# Altium schematic sheet Power.SchDoc
size A4; SheetNumber: 1; SheetTotal: 1
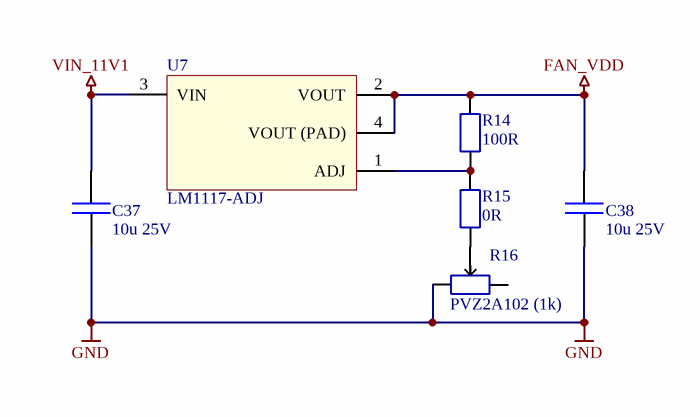
[diagram p0: Power.SchDoc]

## Parts
C37  10u 25V  [C_1206/3216]
C38  10u 25V  [C_1206/3216]
R14  100R  [R_0603/1608]
R15  0R  [R_0603/1608]
R16  PVZ2A102 (1k)  [R_VAR_3.2x3.2_SMD]
U7  LM1117-ADJ  [SOT223]

## Nets
FAN_VDD: C38.1 R14.2 U7.2(VOUT) U7.4(VOUT_(PAD))
GND: C37.2 C38.2 R16.1
VIN_11V1: C37.1 U7.3(VIN)
NetR14_1: R14.1 R15.2 U7.1(ADJ)
NetR15_1: R15.1 R16.2

Not connected (* = marked no-connect by the designer): R16 3

## Library data of the parts
C37 C38 = Capacitor: Non-polarized capacitor
R14 R15 = Resistor
R16 = Resistor variable
U7 = LM1117-ADJ: LDO voltage regulator